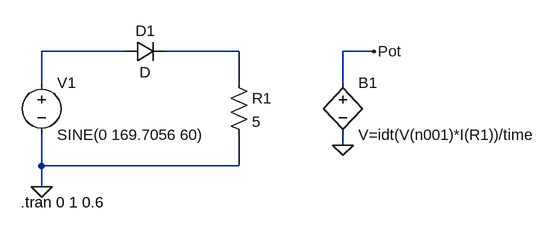
[diagram p0: schematic Atv2p1.asc]
Atv2p1.asc, the LTspice schematic file:
Version 4
SHEET 1 892 680
WIRE 208 80 80 80
WIRE 384 80 272 80
WIRE 592 80 544 80
WIRE 80 128 80 80
WIRE 384 128 384 80
WIRE 544 128 544 80
WIRE 544 224 544 208
WIRE 80 256 80 208
WIRE 384 256 384 208
WIRE 384 256 80 256
WIRE 80 288 80 256
FLAG 80 288 0
FLAG 544 224 0
FLAG 592 80 Pot
SYMBOL voltage 80 112 R0
WINDOW 123 0 0 Left 0
WINDOW 39 0 0 Left 0
SYMATTR InstName V1
SYMATTR Value SINE(0 169.7056 60)
SYMBOL res 368 112 R0
SYMATTR InstName R1
SYMATTR Value 5
SYMBOL bv 544 112 R0
SYMATTR InstName B1
SYMATTR Value V=idt(V(n001)*I(R1))/time
SYMBOL diode 208 96 R270
WINDOW 0 32 32 VTop 2
WINDOW 3 0 32 VBottom 2
SYMATTR InstName D1
TEXT 48 312 Left 2 !.tran 0 1 0.6

The netlist it stands for:
* Atv2p1.asc
V1 N001 0 SINE(0 169.7056 60)
R1 N002 0 5
B1 Pot 0 V=idt(V(n001)*I(R1))/time
D1 N001 N002 D
.model D D
.lib standard.dio
.tran 0 1 0.6
.backanno
.end